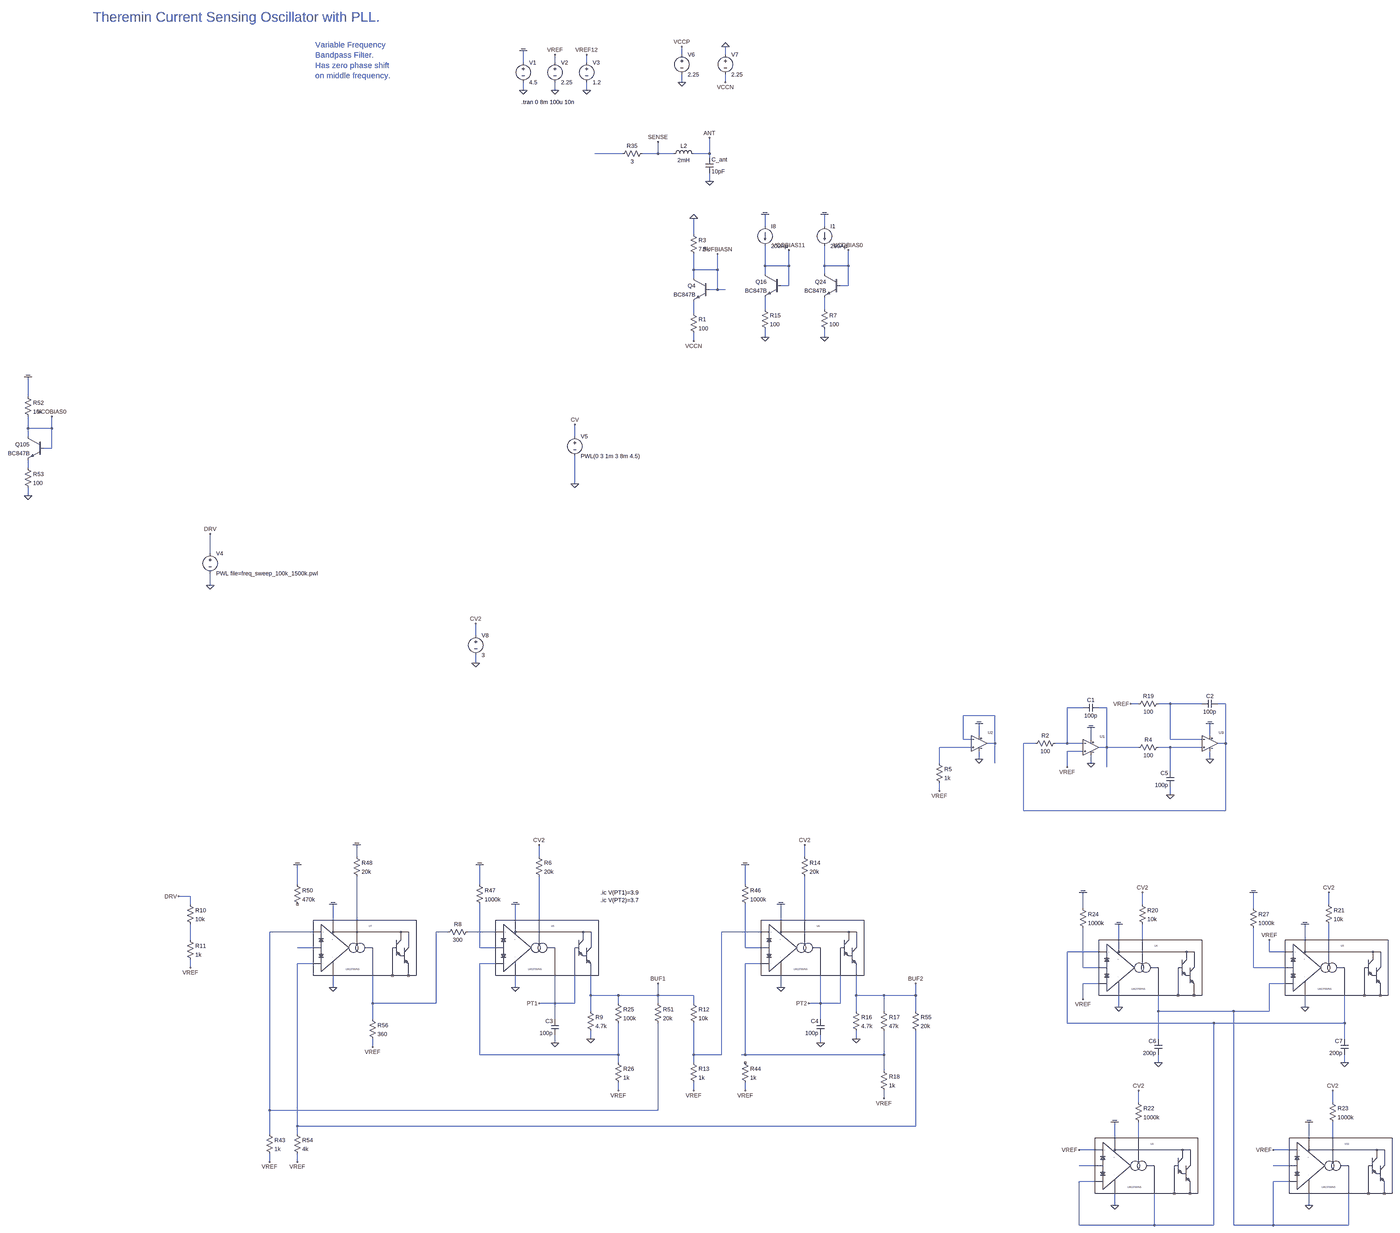
[diagram p0: schematic vco_and_lc_drive_v16.asc, whole sheet]
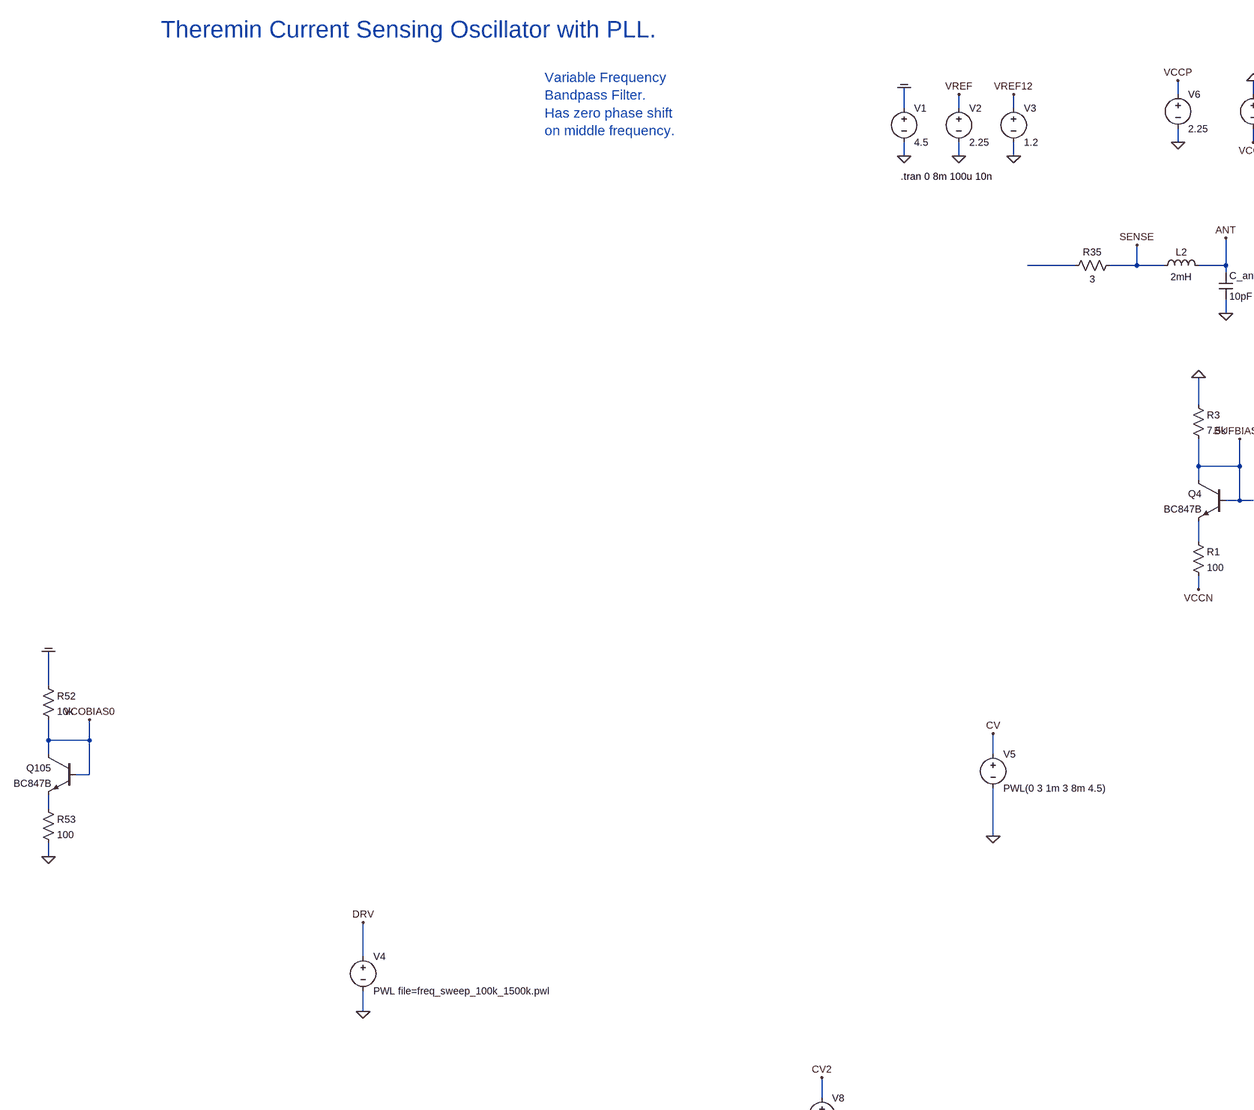
[diagram p1: schematic vco_and_lc_drive_v16.asc, part, row 1 of 2, column 1 of 2]
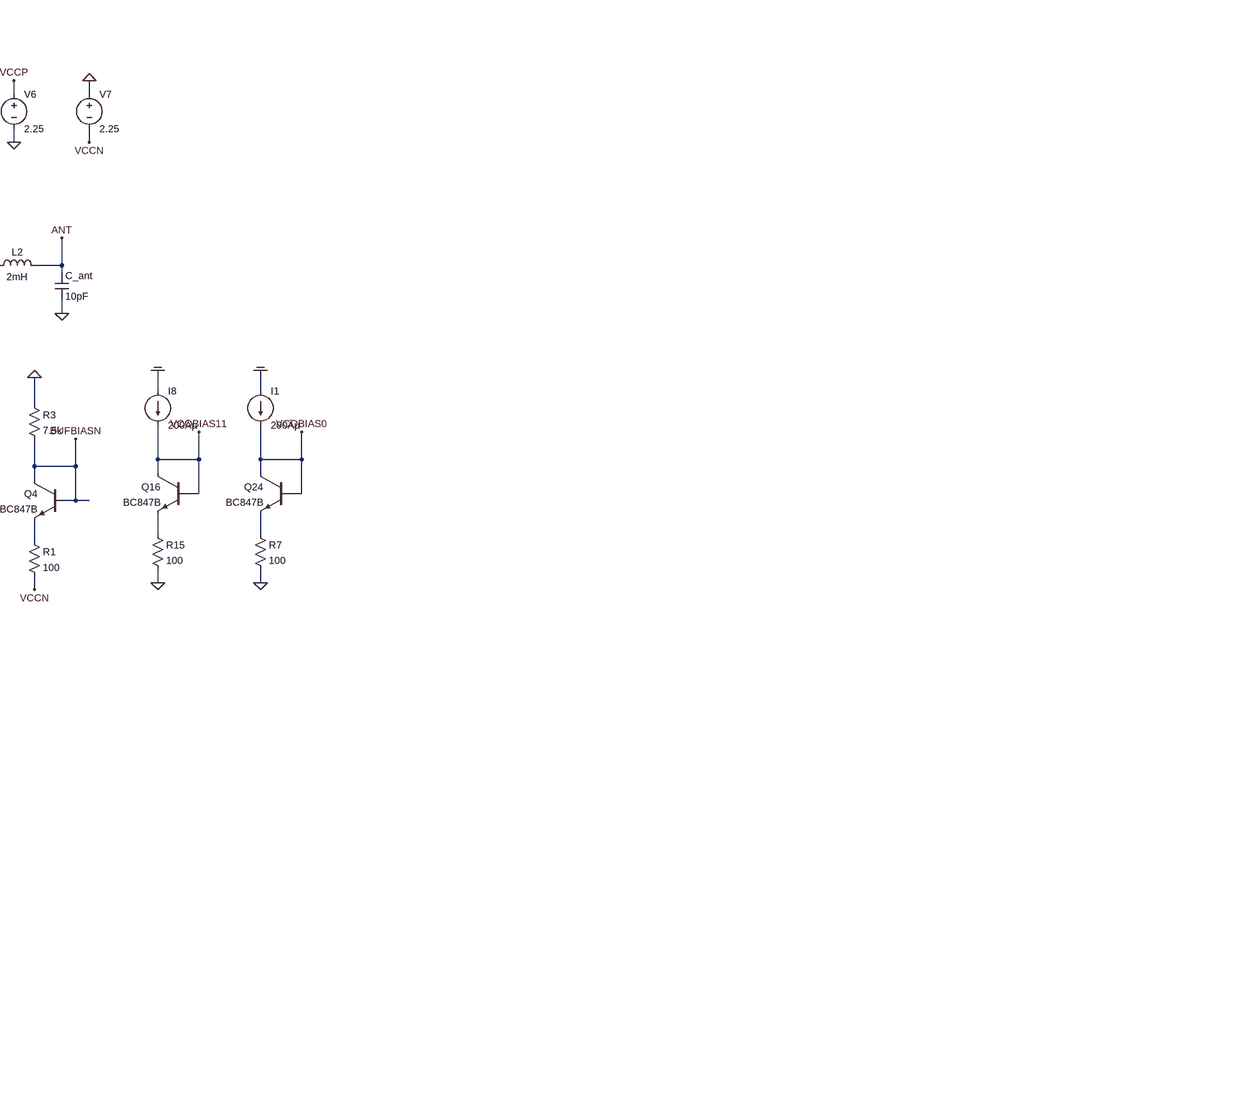
[diagram p2: schematic vco_and_lc_drive_v16.asc, part, row 1 of 2, column 2 of 2]
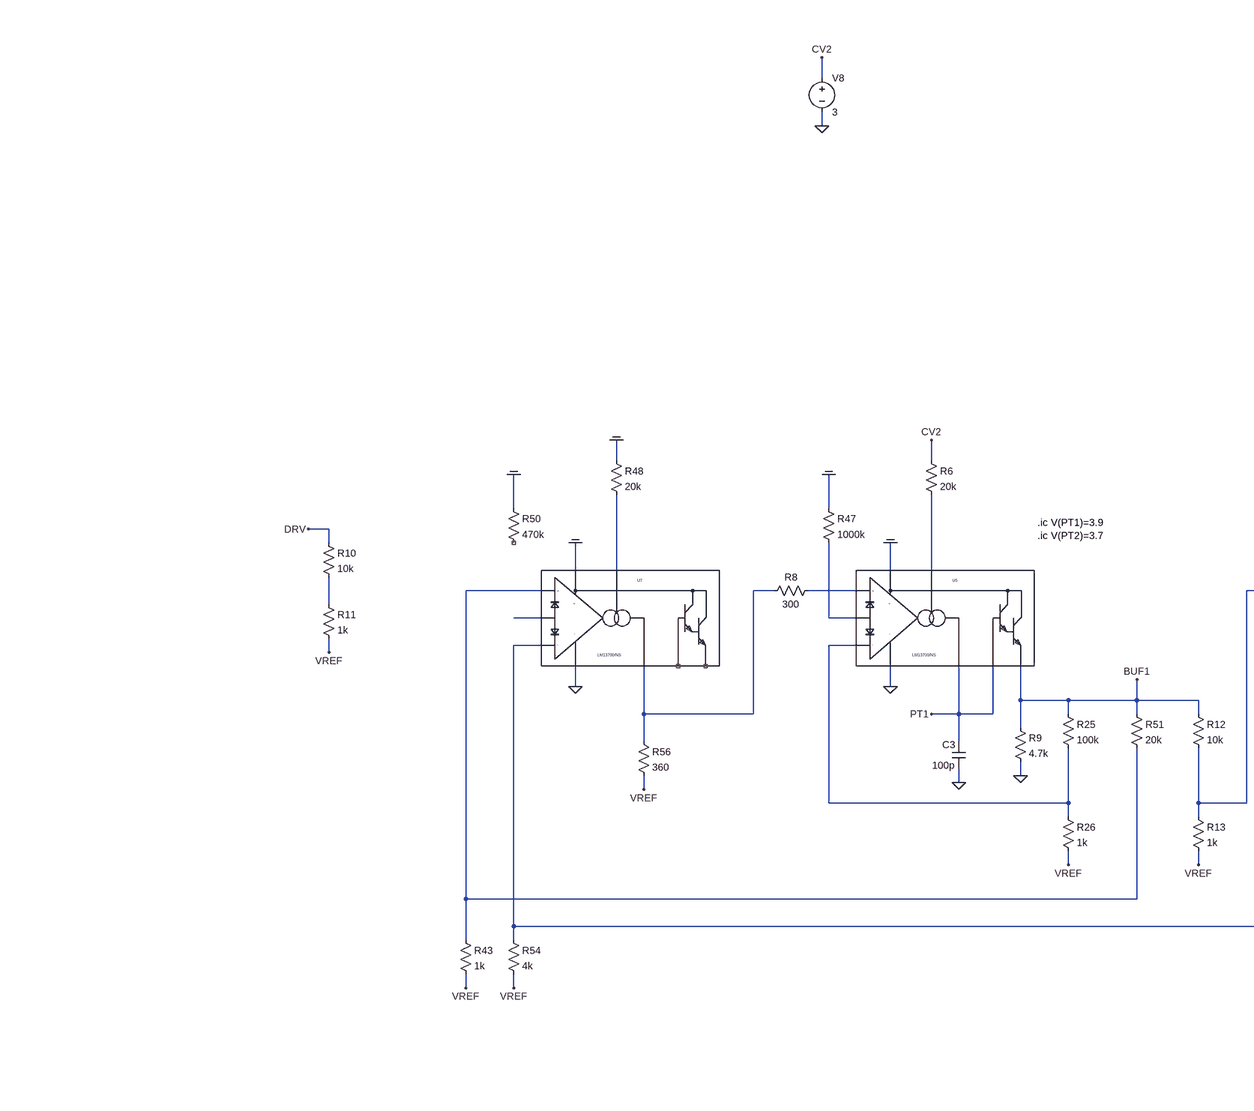
[diagram p3: schematic vco_and_lc_drive_v16.asc, part, row 2 of 2, column 1 of 2]
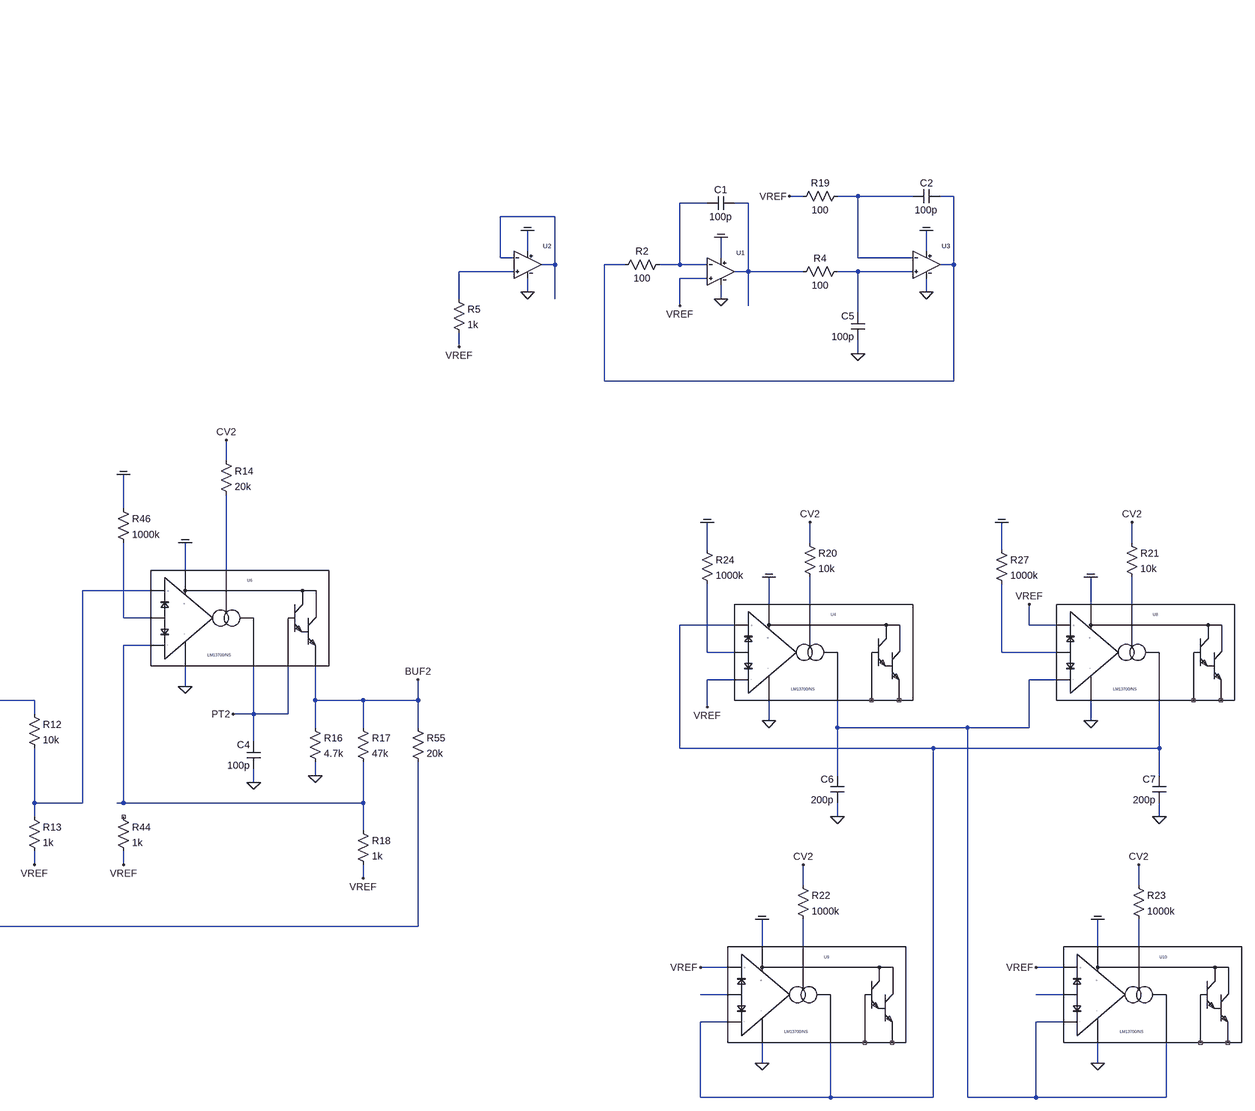
[diagram p4: schematic vco_and_lc_drive_v16.asc, part, row 2 of 2, column 2 of 2]
vco_and_lc_drive_v16.asc, the LTspice schematic file:
Version 4
SHEET 1 13504 29468
WIRE -4960 19040 -4960 19008
WIRE -4784 19040 -4784 19008
WIRE -5600 19072 -5600 19024
WIRE -5472 19072 -5472 19040
WIRE -5344 19072 -5344 19040
WIRE -4960 19152 -4960 19120
WIRE -4784 19152 -4784 19120
WIRE -5600 19184 -5600 19152
WIRE -5472 19184 -5472 19152
WIRE -5344 19184 -5344 19152
WIRE -5200 19440 -5312 19440
WIRE -5056 19440 -5056 19392
WIRE -5056 19440 -5120 19440
WIRE -4992 19440 -5056 19440
WIRE -4848 19440 -4848 19376
WIRE -4848 19440 -4912 19440
WIRE -4848 19456 -4848 19440
WIRE -4848 19552 -4848 19520
WIRE -4624 19856 -4624 19808
WIRE -4384 19856 -4384 19808
WIRE -4912 19888 -4912 19824
WIRE -4624 20016 -4624 19936
WIRE -4528 20016 -4528 19952
WIRE -4528 20016 -4624 20016
WIRE -4384 20016 -4384 19936
WIRE -4288 20016 -4288 19952
WIRE -4288 20016 -4384 20016
WIRE -4912 20032 -4912 19968
WIRE -4816 20032 -4816 19968
WIRE -4816 20032 -4912 20032
WIRE -4624 20048 -4624 20016
WIRE -4384 20048 -4384 20016
WIRE -4912 20064 -4912 20032
WIRE -4528 20096 -4528 20016
WIRE -4528 20096 -4560 20096
WIRE -4288 20096 -4288 20016
WIRE -4288 20096 -4320 20096
WIRE -4816 20112 -4816 20032
WIRE -4816 20112 -4848 20112
WIRE -4784 20112 -4816 20112
WIRE -4624 20192 -4624 20144
WIRE -4384 20192 -4384 20144
WIRE -4912 20208 -4912 20160
WIRE -4624 20304 -4624 20272
WIRE -4384 20304 -4384 20272
WIRE -4912 20320 -4912 20288
WIRE -7904 20928 -7904 20848
WIRE -7904 21056 -7904 21008
WIRE -7808 21056 -7808 21008
WIRE -7808 21056 -7904 21056
WIRE -7904 21088 -7904 21056
WIRE -5392 21088 -5392 21040
WIRE -7808 21136 -7808 21056
WIRE -7808 21136 -7840 21136
WIRE -7904 21216 -7904 21184
WIRE -5392 21280 -5392 21168
WIRE -7904 21328 -7904 21296
WIRE -6864 22176 -6864 22096
WIRE -6864 22304 -6864 22256
WIRE -5792 23088 -5792 23040
WIRE -5792 23200 -5792 23168
WIRE -2640 23776 -2672 23776
WIRE -2512 23776 -2560 23776
WIRE -2384 23776 -2512 23776
WIRE -2288 23776 -2320 23776
WIRE -2864 23792 -2928 23792
WIRE -2768 23792 -2800 23792
WIRE -3696 23824 -3824 23824
WIRE -3760 23904 -3760 23856
WIRE -2352 23904 -2352 23856
WIRE -3824 23920 -3824 23824
WIRE -3792 23920 -3824 23920
WIRE -2832 23920 -2832 23872
WIRE -2512 23920 -2512 23776
WIRE -2384 23920 -2512 23920
WIRE -3696 23936 -3696 23824
WIRE -3696 23936 -3728 23936
WIRE -3056 23936 -3104 23936
WIRE -2928 23936 -2928 23792
WIRE -2928 23936 -2976 23936
WIRE -2864 23936 -2928 23936
WIRE -2288 23936 -2288 23776
WIRE -2288 23936 -2320 23936
WIRE -3792 23952 -3920 23952
WIRE -2768 23952 -2768 23792
WIRE -2768 23952 -2800 23952
WIRE -2640 23952 -2768 23952
WIRE -2512 23952 -2560 23952
WIRE -2384 23952 -2512 23952
WIRE -2864 23968 -2928 23968
WIRE -3760 24000 -3760 23968
WIRE -2352 24000 -2352 23968
WIRE -3920 24016 -3920 23952
WIRE -3696 24016 -3696 23936
WIRE -2832 24016 -2832 23984
WIRE -2928 24032 -2928 23968
WIRE -2768 24032 -2768 23952
WIRE -2512 24048 -2512 23952
WIRE -3920 24128 -3920 24096
WIRE -2512 24144 -2512 24112
WIRE -3104 24208 -3104 23936
WIRE -2288 24208 -2288 23936
WIRE -2288 24208 -3104 24208
WIRE -6272 24928 -6272 24880
WIRE -5536 24928 -5536 24880
WIRE -4464 24928 -4464 24880
WIRE -6512 25040 -6512 24960
WIRE -5776 25040 -5776 24960
WIRE -4704 25040 -4704 24960
WIRE -6944 25088 -6992 25088
WIRE -6944 25120 -6944 25088
WIRE -2624 25120 -2624 25072
WIRE -1872 25120 -1872 25072
WIRE -2864 25136 -2864 25072
WIRE -2176 25136 -2176 25072
WIRE -6368 25184 -6368 25120
WIRE -6272 25184 -6272 25008
WIRE -5632 25184 -5632 25120
WIRE -5536 25184 -5536 25008
WIRE -4560 25184 -4560 25120
WIRE -4464 25184 -4464 25008
WIRE -6448 25232 -6624 25232
WIRE -5904 25232 -5952 25232
WIRE -5712 25232 -5824 25232
WIRE -4640 25232 -4800 25232
WIRE -6944 25264 -6944 25200
WIRE -2720 25264 -2720 25200
WIRE -2624 25264 -2624 25200
WIRE -1968 25264 -1968 25200
WIRE -1872 25264 -1872 25200
WIRE -6448 25296 -6512 25296
WIRE -5776 25296 -5776 25120
WIRE -5712 25296 -5776 25296
WIRE -4704 25296 -4704 25120
WIRE -4640 25296 -4704 25296
WIRE -2800 25312 -2928 25312
WIRE -2112 25312 -2112 25264
WIRE -2048 25312 -2112 25312
WIRE -6448 25360 -6512 25360
WIRE -5712 25360 -5776 25360
WIRE -4640 25360 -4704 25360
WIRE -6944 25376 -6944 25344
WIRE -2864 25376 -2864 25216
WIRE -2800 25376 -2864 25376
WIRE -2176 25376 -2176 25216
WIRE -2048 25376 -2176 25376
WIRE -2800 25440 -2864 25440
WIRE -2048 25440 -2112 25440
WIRE -6368 25456 -6368 25408
WIRE -5632 25456 -5632 25408
WIRE -4560 25456 -4560 25408
WIRE -5328 25488 -5328 25408
WIRE -5216 25488 -5328 25488
WIRE -5056 25488 -5056 25440
WIRE -5056 25488 -5216 25488
WIRE -4912 25488 -5056 25488
WIRE -4256 25488 -4256 25408
WIRE -4144 25488 -4256 25488
WIRE -4016 25488 -4016 25440
WIRE -4016 25488 -4144 25488
WIRE -2864 25504 -2864 25440
WIRE -6208 25520 -6208 25408
WIRE -5952 25520 -5952 25232
WIRE -5952 25520 -6208 25520
WIRE -5472 25520 -5472 25408
WIRE -5472 25520 -5536 25520
WIRE -5392 25520 -5392 25408
WIRE -5392 25520 -5472 25520
WIRE -5216 25520 -5216 25488
WIRE -5056 25520 -5056 25488
WIRE -4912 25520 -4912 25488
WIRE -4400 25520 -4400 25408
WIRE -4400 25520 -4448 25520
WIRE -4320 25520 -4320 25408
WIRE -4320 25520 -4400 25520
WIRE -2720 25536 -2720 25488
WIRE -1968 25536 -1968 25488
WIRE -5328 25552 -5328 25488
WIRE -4256 25552 -4256 25488
WIRE -4144 25552 -4144 25488
WIRE -4016 25552 -4016 25488
WIRE -2560 25552 -2560 25488
WIRE -2256 25552 -2560 25552
WIRE -2112 25552 -2112 25440
WIRE -2112 25552 -2256 25552
WIRE -6208 25584 -6208 25520
WIRE -5472 25584 -5472 25520
WIRE -4400 25584 -4400 25520
WIRE -2928 25600 -2928 25312
WIRE -2336 25600 -2928 25600
WIRE -1808 25600 -1808 25488
WIRE -1808 25600 -2336 25600
WIRE -5328 25664 -5328 25632
WIRE -4256 25664 -4256 25632
WIRE -2560 25664 -2560 25552
WIRE -1808 25664 -1808 25600
WIRE -5472 25680 -5472 25648
WIRE -4400 25680 -4400 25648
WIRE -6208 25696 -6208 25664
WIRE -5776 25728 -5776 25360
WIRE -5216 25728 -5216 25600
WIRE -5216 25728 -5776 25728
WIRE -4912 25728 -4912 25600
WIRE -4800 25728 -4800 25232
WIRE -4800 25728 -4912 25728
WIRE -4704 25728 -4704 25360
WIRE -4704 25728 -4720 25728
WIRE -4144 25728 -4144 25632
WIRE -4144 25728 -4704 25728
WIRE -5216 25760 -5216 25728
WIRE -4912 25760 -4912 25728
WIRE -2560 25760 -2560 25728
WIRE -1808 25760 -1808 25728
WIRE -4144 25792 -4144 25728
WIRE -5216 25872 -5216 25840
WIRE -4912 25872 -4912 25840
WIRE -4704 25872 -4704 25840
WIRE -4144 25904 -4144 25872
WIRE -2640 25920 -2640 25872
WIRE -1856 25920 -1856 25872
WIRE -6624 25952 -6624 25232
WIRE -5056 25952 -5056 25600
WIRE -5056 25952 -6624 25952
WIRE -6512 26016 -6512 25360
WIRE -4016 26016 -4016 25632
WIRE -4016 26016 -6512 26016
WIRE -6624 26048 -6624 25952
WIRE -6512 26048 -6512 26016
WIRE -2736 26064 -2736 26000
WIRE -2640 26064 -2640 26000
WIRE -1952 26064 -1952 26000
WIRE -1856 26064 -1856 26000
WIRE -2816 26112 -2880 26112
WIRE -2032 26112 -2096 26112
WIRE -6624 26160 -6624 26128
WIRE -6512 26160 -6512 26128
WIRE -2816 26176 -2880 26176
WIRE -2032 26176 -2096 26176
WIRE -2816 26240 -2880 26240
WIRE -2032 26240 -2096 26240
WIRE -2736 26336 -2736 26288
WIRE -1952 26336 -1952 26288
WIRE -2880 26416 -2880 26240
WIRE -2576 26416 -2576 26288
WIRE -2576 26416 -2880 26416
WIRE -2336 26416 -2336 25600
WIRE -2336 26416 -2576 26416
WIRE -2256 26416 -2256 25552
WIRE -2096 26416 -2096 26240
WIRE -2096 26416 -2256 26416
WIRE -1792 26416 -1792 26288
WIRE -1792 26416 -2096 26416
FLAG -5600 19184 0
FLAG -5600 19024 COM
FLAG -5472 19184 0
FLAG -5472 19040 VREF
FLAG -4848 19376 ANT
FLAG -5056 19392 SENSE
FLAG -5344 19184 0
FLAG -5344 19040 VREF12
FLAG -7904 20848 COM
FLAG -7904 21328 0
FLAG -7808 21008 VCOBIAS0
FLAG -4960 19152 0
FLAG -4960 19008 VCCP
FLAG -4784 19008 0
FLAG -4784 19152 VCCN
FLAG -4912 20320 VCCN
FLAG -4912 19824 0
FLAG -4816 19968 BUFBIASN
FLAG -4848 19552 0
FLAG -4624 20304 0
FLAG -4528 19952 VCOBIAS11
FLAG -4624 19808 COM
FLAG -4384 20304 0
FLAG -4288 19952 VCOBIAS0
FLAG -4384 19808 COM
FLAG -6864 22304 0
FLAG -6864 22096 DRV
FLAG -3760 24000 0
FLAG -5392 21040 CV
FLAG -5392 21280 0
FLAG -5792 23040 CV2
FLAG -5792 23200 0
FLAG -3760 23856 COM
FLAG -3920 24128 VREF
FLAG -5632 25456 0
FLAG -5632 25120 COM
FLAG -5776 24960 COM
FLAG -5536 24880 CV2
FLAG -6992 25088 DRV
FLAG -5472 25680 0
FLAG -5328 25664 0
FLAG -4912 25872 VREF
FLAG -4560 25456 0
FLAG -4560 25120 COM
FLAG -4704 24960 COM
FLAG -4464 24880 CV2
FLAG -4400 25680 0
FLAG -4256 25664 0
FLAG -4144 25904 VREF
FLAG -6944 25376 VREF
FLAG -5216 25872 VREF
FLAG -4704 25872 VREF
FLAG -6368 25456 0
FLAG -6368 25120 COM
FLAG -6512 24960 COM
FLAG -6512 26160 VREF
FLAG -6208 25696 VREF
FLAG -6272 24880 COM
FLAG -6624 26160 VREF
FLAG -5536 25520 PT1
FLAG -4448 25520 PT2
FLAG -5056 25440 BUF1
FLAG -4016 25440 BUF2
FLAG -2832 24016 0
FLAG -2832 23872 COM
FLAG -2352 24000 0
FLAG -2352 23856 COM
FLAG -2512 24144 0
FLAG -2672 23776 VREF
FLAG -2928 24032 VREF
FLAG -2720 25536 0
FLAG -2720 25200 COM
FLAG -2624 25072 CV2
FLAG -2560 25760 0
FLAG -1968 25536 0
FLAG -1968 25200 COM
FLAG -1872 25072 CV2
FLAG -1808 25760 0
FLAG -2864 25504 VREF
FLAG -2112 25264 VREF
FLAG -2736 26336 0
FLAG -2736 26000 COM
FLAG -2640 25872 CV2
FLAG -2880 26112 VREF
FLAG -1952 26336 0
FLAG -1952 26000 COM
FLAG -1856 25872 CV2
FLAG -2096 26112 VREF
FLAG -2864 25072 COM
FLAG -2176 25072 COM
SYMBOL voltage -5600 19056 R0
SYMATTR InstName V1
SYMATTR Value 4.5
SYMBOL Voltage -5472 19056 R0
SYMATTR InstName V2
SYMATTR Value 2.25
SYMBOL ind -5008 19456 R270
WINDOW 0 32 56 VTop 2
WINDOW 3 5 56 VBottom 2
SYMATTR InstName L2
SYMATTR Value 2mH
SYMATTR SpiceLine Rser=120 Cpar=1pF
SYMBOL Cap -4864 19456 R0
SYMATTR InstName C_ant
SYMATTR Value 10pF
SYMBOL Res -5216 19456 R270
WINDOW 0 32 56 VTop 2
WINDOW 3 0 56 VBottom 2
SYMATTR InstName R35
SYMATTR Value 3
SYMBOL Voltage -5344 19056 R0
SYMATTR InstName V3
SYMATTR Value 1.2
SYMBOL npn -7840 21088 M0
SYMATTR InstName Q105
SYMATTR Value BC847B
SYMBOL Res -7920 20912 R0
SYMATTR InstName R52
SYMATTR Value 10k
SYMBOL Res -7920 21200 R0
SYMATTR InstName R53
SYMATTR Value 100
SYMBOL Voltage -4960 19024 R0
SYMATTR InstName V6
SYMATTR Value 2.25
SYMBOL Voltage -4784 19024 R0
SYMATTR InstName V7
SYMATTR Value 2.25
SYMBOL npn -4848 20064 M0
SYMATTR InstName Q4
SYMATTR Value BC847B
SYMBOL Res -4928 20192 R0
SYMATTR InstName R1
SYMATTR Value 100
SYMBOL Res -4928 19872 R0
SYMATTR InstName R3
SYMATTR Value 7.5k
SYMBOL npn -4560 20048 M0
SYMATTR InstName Q16
SYMATTR Value BC847B
SYMBOL Res -4640 20176 R0
SYMATTR InstName R15
SYMATTR Value 100
SYMBOL current -4624 19856 R0
SYMATTR InstName I8
SYMATTR Value 200Âµ
SYMBOL npn -4320 20048 M0
SYMATTR InstName Q24
SYMATTR Value BC847B
SYMBOL Res -4400 20176 R0
SYMATTR InstName R7
SYMATTR Value 100
SYMBOL current -4384 19856 R0
SYMATTR InstName I1
SYMATTR Value 200Âµ
SYMBOL Voltage -6864 22160 R0
SYMATTR InstName V4
SYMATTR Value PWL file=freq_sweep_100k_1500k.pwl
SYMBOL MCP6021 -3760 23936 R0
SYMATTR InstName U2
SYMBOL Voltage -5392 21072 R0
SYMATTR InstName V5
SYMATTR Value PWL(0 3 1m 3 8m 4.5)
SYMBOL Voltage -5792 23072 R0
SYMATTR InstName V8
SYMATTR Value 3
SYMBOL Res -3936 24000 R0
SYMATTR InstName R5
SYMATTR Value 1k
SYMBOL LM13700 -5632 25296 R0
SYMATTR InstName U5
SYMBOL Res -5552 24912 R0
SYMATTR InstName R6
SYMATTR Value 20k
SYMBOL Res -5808 25216 R90
WINDOW 0 0 56 VBottom 2
WINDOW 3 32 56 VTop 2
SYMATTR InstName R8
SYMATTR Value 300
SYMBOL Cap -5456 25648 R180
WINDOW 0 24 56 Left 2
WINDOW 3 24 8 Left 2
SYMATTR InstName C3
SYMATTR Value 100p
SYMBOL Res -5344 25536 R0
SYMATTR InstName R9
SYMATTR Value 4.7k
SYMBOL Res -6960 25104 R0
SYMATTR InstName R10
SYMATTR Value 10k
SYMBOL Res -6960 25248 R0
SYMATTR InstName R11
SYMATTR Value 1k
SYMBOL Res -4928 25504 R0
SYMATTR InstName R12
SYMATTR Value 10k
SYMBOL Res -4928 25744 R0
SYMATTR InstName R13
SYMATTR Value 1k
SYMBOL LM13700 -4560 25296 R0
SYMATTR InstName U6
SYMBOL Res -4480 24912 R0
SYMATTR InstName R14
SYMATTR Value 20k
SYMBOL Cap -4384 25648 R180
WINDOW 0 24 56 Left 2
WINDOW 3 24 8 Left 2
SYMATTR InstName C4
SYMATTR Value 100p
SYMBOL Res -4272 25536 R0
SYMATTR InstName R16
SYMATTR Value 4.7k
SYMBOL Res -4160 25536 R0
SYMATTR InstName R17
SYMATTR Value 47k
SYMBOL Res -4160 25776 R0
SYMATTR InstName R18
SYMATTR Value 1k
SYMBOL Res -5232 25504 R0
SYMATTR InstName R25
SYMATTR Value 100k
SYMBOL Res -5232 25744 R0
SYMATTR InstName R26
SYMATTR Value 1k
SYMBOL Res -4720 25744 R0
SYMATTR InstName R44
SYMATTR Value 1k
SYMBOL Res -4720 25024 R0
SYMATTR InstName R46
SYMATTR Value 1000k
SYMBOL Res -5792 25024 R0
SYMATTR InstName R47
SYMATTR Value 1000k
SYMBOL LM13700 -6368 25296 R0
SYMATTR InstName U7
SYMBOL Res -6288 24912 R0
SYMATTR InstName R48
SYMATTR Value 20k
SYMBOL Res -6528 25024 R0
SYMATTR InstName R50
SYMATTR Value 470k
SYMBOL Res -5072 25504 R0
SYMATTR InstName R51
SYMATTR Value 20k
SYMBOL Res -4032 25536 R0
SYMATTR InstName R55
SYMATTR Value 20k
SYMBOL Res -6528 26032 R0
SYMATTR InstName R54
SYMATTR Value 4k
SYMBOL Res -6224 25568 R0
SYMATTR InstName R56
SYMATTR Value 360
SYMBOL Res -6640 26032 R0
SYMATTR InstName R43
SYMATTR Value 1k
SYMBOL MCP6021 -2832 23952 R0
SYMATTR InstName U1
SYMBOL Cap -2800 23776 R90
WINDOW 0 0 32 VBottom 2
WINDOW 3 32 32 VTop 2
SYMATTR InstName C1
SYMATTR Value 100p
SYMBOL Res -2960 23920 R90
WINDOW 0 0 56 VBottom 2
WINDOW 3 32 56 VTop 2
SYMATTR InstName R2
SYMATTR Value 100
SYMBOL MCP6021 -2352 23936 R0
SYMATTR InstName U3
SYMBOL Cap -2320 23760 R90
WINDOW 0 0 32 VBottom 2
WINDOW 3 32 32 VTop 2
SYMATTR InstName C2
SYMATTR Value 100p
SYMBOL Res -2544 23936 R90
WINDOW 0 0 56 VBottom 2
WINDOW 3 32 56 VTop 2
SYMATTR InstName R4
SYMATTR Value 100
SYMBOL Cap -2496 24112 R180
WINDOW 0 24 56 Left 2
WINDOW 3 24 8 Left 2
SYMATTR InstName C5
SYMATTR Value 100p
SYMBOL Res -2544 23760 R90
WINDOW 0 0 56 VBottom 2
WINDOW 3 32 56 VTop 2
SYMATTR InstName R19
SYMATTR Value 100
SYMBOL LM13700 -2720 25376 R0
SYMATTR InstName U4
SYMBOL Res -2640 25104 R0
SYMATTR InstName R20
SYMATTR Value 10k
SYMBOL Cap -2544 25728 R180
WINDOW 0 24 56 Left 2
WINDOW 3 24 8 Left 2
SYMATTR InstName C6
SYMATTR Value 200p
SYMBOL LM13700 -1968 25376 R0
SYMATTR InstName U8
SYMBOL Res -1888 25104 R0
SYMATTR InstName R21
SYMATTR Value 10k
SYMBOL Cap -1792 25728 R180
WINDOW 0 24 56 Left 2
WINDOW 3 24 8 Left 2
SYMATTR InstName C7
SYMATTR Value 200p
SYMBOL LM13700 -2736 26176 R0
SYMATTR InstName U9
SYMBOL Res -2656 25904 R0
SYMATTR InstName R22
SYMATTR Value 1000k
SYMBOL LM13700 -1952 26176 R0
SYMATTR InstName U10
SYMBOL Res -1872 25904 R0
SYMATTR InstName R23
SYMATTR Value 1000k
SYMBOL Res -2880 25120 R0
SYMATTR InstName R24
SYMATTR Value 1000k
SYMBOL Res -2192 25120 R0
SYMATTR InstName R27
SYMATTR Value 1000k
TEXT -5608 19232 Left 2 !.tran 0 8m 100u 10n
TEXT -7336 18888 Left 5 ;Theremin Current Sensing Oscillator with PLL.
TEXT -6440 19000 Left 3 ;Variable Frequency \nBandpass Filter.\nHas zero phase shift \non middle frequency.
TEXT -5288 25072 Left 2 !.ic V(PT1)=3.9\n.ic V(PT2)=3.7

The netlist it stands for:
* vco_and_lc_drive_v16.asc
V1 COM 0 4.5
V2 VREF 0 2.25
L2 SENSE ANT 2mH Rser=120 Cpar=1pF
C_ant ANT 0 10pF
R35 N001 SENSE 3
V3 VREF12 0 1.2
Q105 VCOBIAS0 VCOBIAS0 N005 0 BC847B
R52 COM VCOBIAS0 10k
R53 N005 0 100
V6 VCCP 0 2.25
V7 0 VCCN 2.25
Q4 BUFBIASN BUFBIASN N004 0 BC847B
R1 N004 VCCN 100
R3 0 BUFBIASN 7.5k
Q16 VCOBIAS11 VCOBIAS11 N002 0 BC847B
R15 N002 0 100
I8 COM VCOBIAS11 200Âµ
Q24 VCOBIAS0 VCOBIAS0 N003 0 BC847B
R7 N003 0 100
I1 COM VCOBIAS0 200Âµ
V4 DRV 0 PWL file=freq_sweep_100k_1500k.pwl
XU2 N011 N010 COM 0 N010 MCP6021  ; pins In+ In- V+ V- OUT
V5 CV 0 PWL(0 3 1m 3 8m 4.5)
V8 CV2 0 3
R5 N011 VREF 1k
XU5 N014 N024 N018 N028 PT1 0 PT1 BUF1 COM LM13700/NS  ; pins Ibias Dio_bias in+ in- out V- buf_in buf_out V+
R6 CV2 N014 20k
R8 N018 N017 300
C3 0 PT1 100p
R9 BUF1 0 4.7k
R10 DRV N020 10k
R11 N020 VREF 1k
R12 BUF1 N019 10k
R13 N019 VREF 1k
XU6 N015 N025 N019 N029 PT2 0 PT2 BUF2 COM LM13700/NS  ; pins Ibias Dio_bias in+ in- out V- buf_in buf_out V+
R14 CV2 N015 20k
C4 0 PT2 100p
R16 BUF2 0 4.7k
R17 BUF2 N029 47k
R18 N029 VREF 1k
R25 BUF1 N028 100k
R26 N028 VREF 1k
R44 NC_01 VREF 1k
R46 COM N025 1000k
R47 COM N024 1000k
XU7 N013 N023 N016 N027 N017 0 NC_02 NC_03 COM LM13700/NS  ; pins Ibias Dio_bias in+ in- out V- buf_in buf_out V+
R48 COM N013 20k
R50 COM NC_04 470k
R51 BUF1 N016 20k
R55 BUF2 N027 20k
R54 N027 VREF 4k
R56 N017 VREF 360
R43 N016 VREF 1k
XU1 VREF N008 COM 0 N009 MCP6021  ; pins In+ In- V+ V- OUT
C1 N009 N008 100p
R2 N008 N007 100
XU3 N012 N006 COM 0 N007 MCP6021  ; pins In+ In- V+ V- OUT
C2 N007 N006 100p
R4 N012 N009 100
C5 0 N012 100p
R19 N006 VREF 100
XU4 N021 N030 N026 VREF N032 0 NC_05 NC_06 COM LM13700/NS  ; pins Ibias Dio_bias in+ in- out V- buf_in buf_out V+
R20 CV2 N021 10k
C6 0 N032 200p
XU8 N022 N031 VREF N032 N026 0 NC_07 NC_08 COM LM13700/NS  ; pins Ibias Dio_bias in+ in- out V- buf_in buf_out V+
R21 CV2 N022 10k
C7 0 N026 200p
XU9 N033 N035 VREF N026 N026 0 NC_09 NC_10 COM LM13700/NS  ; pins Ibias Dio_bias in+ in- out V- buf_in buf_out V+
R22 CV2 N033 1000k
XU10 N034 N036 VREF N032 N032 0 NC_11 NC_12 COM LM13700/NS  ; pins Ibias Dio_bias in+ in- out V- buf_in buf_out V+
R23 CV2 N034 1000k
R24 COM N030 1000k
R27 COM N031 1000k
.model NPN NPN
.model PNP PNP
.lib standard.bjt
.tran 0 8m 100u 10n
* Theremin Current Sensing Oscillator with PLL.
* Variable Frequency
* Bandpass Filter.
* Has zero phase shift
* on middle frequency.
.ic V(PT1)=3.9
.ic V(PT2)=3.7
.lib MCP6021.cir
.lib ns_models.lib
.backanno
.end